# Altium schematic sheet 04_RSVD.SchDoc
size A3; DocumentNumber: 4; SheetNumber: 4; SheetTotal: 21
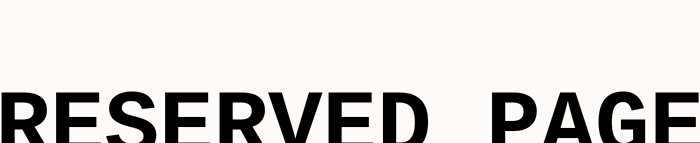
[diagram p0: 04_RSVD.SchDoc]

## Notes on the sheet
- RESERVED PAGE